# Altium schematic sheet RcTransmitterSwitches.SchDoc
size A4; SheetNumber: 3; SheetTotal: 3
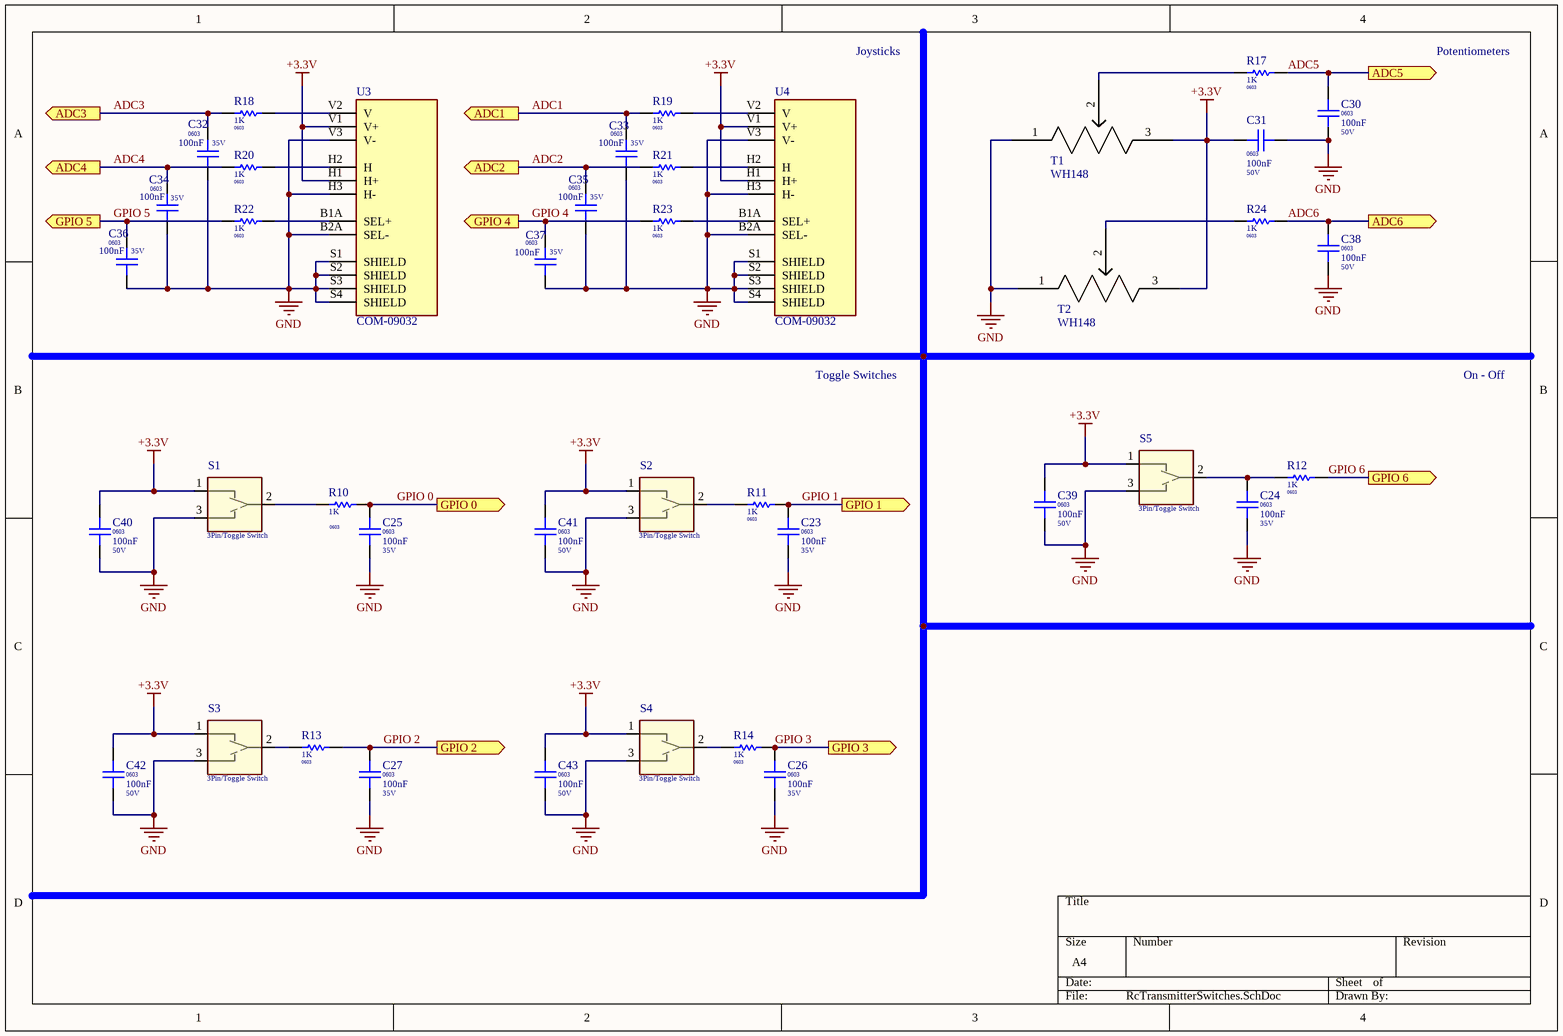
[diagram p0: RcTransmitterSwitches.SchDoc]

## Parts
C23  Package / Case: 0603  Voltage: 35V  [CAPC 0603]  (hidden comment: 100nF)
C24  Package / Case: 0603  Voltage: 35V  [CAPC 0603]  (hidden comment: 100nF)
C25  Package / Case: 0603  Voltage: 35V  [CAPC 0603]  (hidden comment: 100nF)
C26  Package / Case: 0603  Voltage: 35V  [CAPC 0603]  (hidden comment: 100nF)
C27  Package / Case: 0603  Voltage: 35V  [CAPC 0603]  (hidden comment: 100nF)
C30  Package / Case: 0603  Voltage: 50V  [CAPC 0603]  (hidden comment: 100nF)
C31  Package / Case: 0603  Voltage: 50V  [CAPC 0603]  (hidden comment: 100nF)
C32  Package / Case: 0603  Voltage: 35V  [CAPC 0603]  (hidden comment: 100nF)
C33  Package / Case: 0603  Voltage: 35V  [CAPC 0603]  (hidden comment: 100nF)
C34  Package / Case: 0603  Voltage: 35V  [CAPC 0603]  (hidden comment: 100nF)
C35  Package / Case: 0603  Voltage: 35V  [CAPC 0603]  (hidden comment: 100nF)
C36  Package / Case: 0603  Voltage: 35V  [CAPC 0603]  (hidden comment: 100nF)
C37  Package / Case: 0603  Voltage: 35V  [CAPC 0603]  (hidden comment: 100nF)
C38  Package / Case: 0603  Voltage: 50V  [CAPC 0603]  (hidden comment: 100nF)
C39  Package / Case: 0603  Voltage: 50V  [CAPC 0603]  (hidden comment: 100nF)
C40  Package / Case: 0603  Voltage: 50V  [CAPC 0603]  (hidden comment: 100nF)
C41  Package / Case: 0603  Voltage: 50V  [CAPC 0603]  (hidden comment: 100nF)
C42  Package / Case: 0603  Voltage: 50V  [CAPC 0603]  (hidden comment: 100nF)
C43  Package / Case: 0603  Voltage: 50V  [CAPC 0603]  (hidden comment: 100nF)
R10  Package / Case: 0603  [RESC 0603]  (hidden comment: 1K)
R11  Package / Case: 0603  [RESC 0603]  (hidden comment: 1K)
R12  Package / Case: 0603  [RESC 0603]  (hidden comment: 1K)
R13  Package / Case: 0603  [RESC 0603]  (hidden comment: 1K)
R14  Package / Case: 0603  [RESC 0603]  (hidden comment: 1K)
R17  Package / Case: 0603  [RESC 0603]  (hidden comment: 1K)
R18  Package / Case: 0603  [RESC 0603]  (hidden comment: 1K)
R19  Package / Case: 0603  [RESC 0603]  (hidden comment: 1K)
R20  Package / Case: 0603  [RESC 0603]  (hidden comment: 1K)
R21  Package / Case: 0603  [RESC 0603]  (hidden comment: 1K)
R22  Package / Case: 0603  [RESC 0603]  (hidden comment: 1K)
R23  Package / Case: 0603  [RESC 0603]  (hidden comment: 1K)
R24  Package / Case: 0603  [RESC 0603]  (hidden comment: 1K)
S1  3Pin/Toggle Switch  [3Pin/Toggle Switch]
S2  3Pin/Toggle Switch  [3Pin/Toggle Switch]
S3  3Pin/Toggle Switch  [3Pin/Toggle Switch]
S4  3Pin/Toggle Switch  [3Pin/Toggle Switch]
S5  3Pin/Toggle Switch  [3Pin/Toggle Switch]
T1  WH148  [WH148]
T2  WH148  [WH148]
U3  COM-09032  [XDCR_COM-09032]
U4  COM-09032  [XDCR_COM-09032]

## Ports
ADC1 (out), ADC2 (out), ADC3 (out), ADC4 (out), ADC5 (out), ADC6 (out), GPIO 0 (out), GPIO 1 (out), GPIO 2 (out), GPIO 3 (out), GPIO 4 (out), GPIO 5 (out), GPIO 6 (out)

## Nets
+3.3V: C31.2 C39.2 C40.2 C41.2 C42.2 C43.2 S1.1 S2.1 S3.1 S4.1 S5.1 T1.3 T2.3 U3.H1(H+) U3.V1(V+) U4.H1(H+) U4.V1(V+)
GND: C23.1 C24.1 C25.1 C26.1 C27.1 C30.2 C31.1 C32.1 C33.1 C34.1 C35.1 C36.1 C37.1 C38.2 C39.1 C40.1 C41.1 C42.1 C43.1 S1.3 S2.3 S3.3 S4.3 S5.3 T1.1 T2.1 U3.B2A(SEL-) U3.H3(H-) U3.S1(SHIELD) U3.S2(SHIELD) U3.S3(SHIELD) U3.S4(SHIELD) U3.V3(V-) U4.B2A(SEL-) U4.H3(H-) U4.S1(SHIELD) U4.S2(SHIELD) U4.S3(SHIELD) U4.S4(SHIELD) U4.V3(V-)
ADC1: C33.2 R19.1 ; port ADC1
ADC2: C35.2 R21.1 ; port ADC2
ADC3: C32.2 R18.1 ; port ADC3
ADC4: C34.2 R20.1 ; port ADC4
ADC5: C30.1 R17.2 ; port ADC5
ADC6: C38.1 R24.2 ; port ADC6
GPIO 0: C25.2 R10.2 ; port GPIO 0
GPIO 1: C23.2 R11.2 ; port GPIO 1
GPIO 2: C27.2 R13.2 ; port GPIO 2
GPIO 3: C26.2 R14.1 ; port GPIO 3
GPIO 4: C37.2 R23.1 ; port GPIO 4
GPIO 5: C36.2 R22.1 ; port GPIO 5
GPIO 6: R12.2 ; port GPIO 6
NetC24_2: C24.2 R12.1 S5.2
NetR10_1: R10.1 S1.2
NetR11_1: R11.1 S2.2
NetR13_1: R13.1 S3.2
NetR14_2: R14.2 S4.2
NetR17_1: R17.1 T1.2
NetR18_2: R18.2 U3.V2(V)
NetR19_2: R19.2 U4.V2(V)
NetR20_2: R20.2 U3.H2(H)
NetR21_2: R21.2 U4.H2(H)
NetR22_2: R22.2 U3.B1A(SEL+)
NetR23_2: R23.2 U4.B1A(SEL+)
NetR24_1: R24.1 T2.2

## Notes on the sheet
- Joysticks
- Potentiometers
- Toggle Switches
- On - Off

## Library data of the parts
C23-C27 C32-C37 = CAPC0328: Capacitor Ceramic 100nF 35V 0603; Tolerance: %10; Value Rating: nF; Value: 100nF; Part Number: CAPC0328; Category: Capacitor Ceramic; Values: 100nF 35V
C30 C31 C38-C43 = CAPC0285: Capacitor Ceramic 100nF 50V 0603; Tolerance: %10; Value Rating: nF; Favorites: Favorite; Value: 100nF; Part Number: CAPC0285; Category: Capacitor Ceramic; Values: 100nF 50V
R10-R14 R17-R24 = R0196: 1K 0603; Part Number: R0196; Tolerance: %5; Power: 1/10W; Value: 1K; Category: Resistor; Values: 1K
S1-S5 = 4-1825136-5: Switch Toggle ON None ON SPDT Long Baton Lever PC Pins 5A 250VAC 28VDC PC Mount with Threads Bulk; MF: TE Connectivity; SnapEDA_Link: https://www.snapeda.com/parts/4-1825136-5/TE%20Connectivity%20ALCOSWITCH%20Switches/view-part/?ref=snap; Price: None; TE_purchase_URL: https://www.te.com/usa-en/product-4-1825136-5.html?te_bu=Cor&te_type=disp&te_campaign=seda_glo_cor-seda-global-disp-prtnr-fy19-seda-model-bom-cta_sma-317_1&elqCampaignId=32493; EU_RoHS_Compliance: Compliant with Exemptions; Package: SOIC-8 TE Connectivity; Availability: Unavailable; MP: 4-1825136-5; Value: *; Supplier 1: Digi-Key; Supplier Part Number 1: 450-1784-ND; Name: 3Pin/Toggle Switch
U3 U4 = COM-09032: Joystick, 2 - Axis Analog _Resistive_ Output; MF: SparkFun Electronics; SnapEDA_Link: https://www.snapeda.com/parts/COM-09032/SparkFun%20Electronics/view-part/888157/?ref=snap; Availability: Unavailable; Value: *; Price: None; MP: COM-09032; Package: SparkFun Electronics